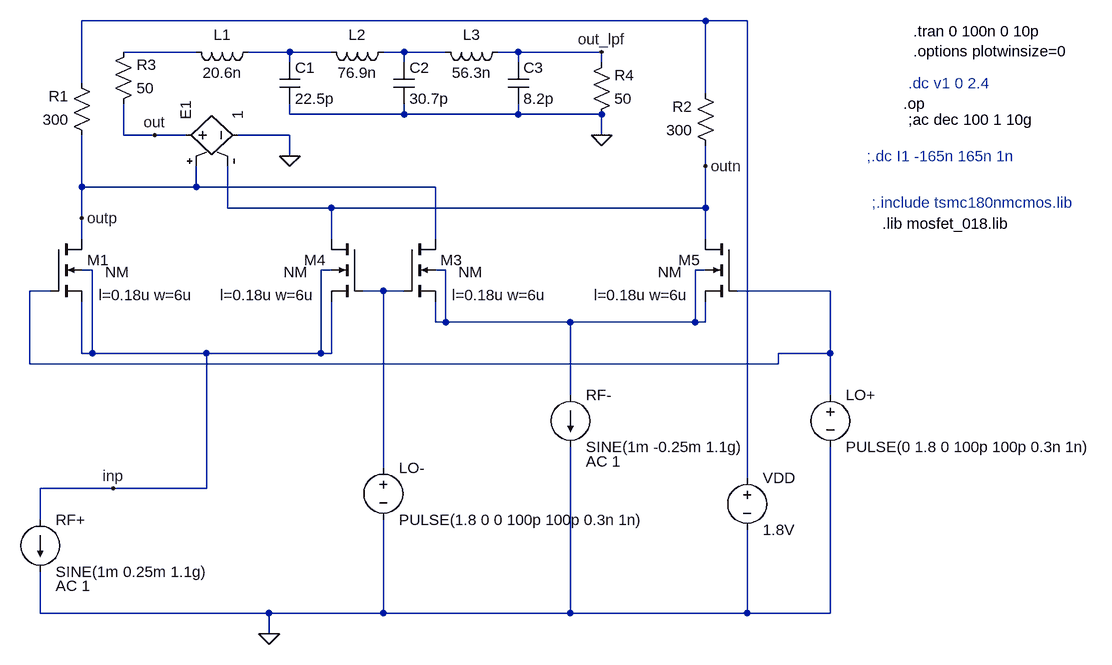
[diagram p0: schematic test_cmos_mixer.asc]
test_cmos_mixer.asc, the LTspice schematic file:
Version 4
SHEET 1 2264 2956
WIRE 1024 -496 64 -496
WIRE 1088 -496 1024 -496
WIRE 240 -448 128 -448
WIRE 384 -448 320 -448
WIRE 448 -448 384 -448
WIRE 560 -448 528 -448
WIRE 624 -448 560 -448
WIRE 736 -448 704 -448
WIRE 864 -448 736 -448
WIRE 384 -432 384 -448
WIRE 560 -432 560 -448
WIRE 736 -432 736 -448
WIRE 864 -432 864 -448
WIRE 64 -400 64 -496
WIRE 1024 -384 1024 -496
WIRE 384 -352 384 -368
WIRE 560 -352 560 -368
WIRE 560 -352 384 -352
WIRE 736 -352 736 -368
WIRE 736 -352 560 -352
WIRE 864 -352 736 -352
WIRE 128 -320 128 -368
WIRE 176 -320 128 -320
WIRE 224 -320 176 -320
WIRE 384 -320 304 -320
WIRE 864 -320 864 -352
WIRE 384 -288 384 -320
WIRE 1024 -272 1024 -304
WIRE 64 -240 64 -320
WIRE 240 -240 240 -272
WIRE 240 -240 64 -240
WIRE 608 -240 240 -240
WIRE 288 -208 288 -272
WIRE 448 -208 288 -208
WIRE 1024 -208 1024 -272
WIRE 1024 -208 448 -208
WIRE 64 -192 64 -240
WIRE 64 -160 64 -192
WIRE 448 -160 448 -208
WIRE 608 -160 608 -240
WIRE 1024 -160 1024 -208
WIRE 80 -112 64 -112
WIRE 448 -112 432 -112
WIRE 624 -112 608 -112
WIRE 1024 -112 1008 -112
WIRE 16 -80 -16 -80
WIRE 528 -80 496 -80
WIRE 560 -80 528 -80
WIRE 1216 -80 1072 -80
WIRE 608 -32 608 -64
WIRE 624 -32 624 -112
WIRE 624 -32 608 -32
WIRE 816 -32 624 -32
WIRE 1008 -32 1008 -112
WIRE 1008 -32 816 -32
WIRE 1024 -32 1024 -64
WIRE 1024 -32 1008 -32
WIRE 64 16 64 -64
WIRE 80 16 80 -112
WIRE 80 16 64 16
WIRE 256 16 80 16
WIRE 432 16 432 -112
WIRE 432 16 256 16
WIRE 448 16 448 -64
WIRE 448 16 432 16
WIRE 1216 16 1216 -80
WIRE 1216 16 1136 16
WIRE -16 32 -16 -80
WIRE 1136 32 1136 16
WIRE 1136 32 -16 32
WIRE 816 80 816 -32
WIRE 1216 80 1216 16
WIRE 528 192 528 -80
WIRE 1088 208 1088 -496
WIRE 112 224 0 224
WIRE 256 224 256 16
WIRE 256 224 112 224
WIRE 0 272 0 224
WIRE 0 416 0 352
WIRE 352 416 0 416
WIRE 528 416 528 272
WIRE 528 416 352 416
WIRE 816 416 816 160
WIRE 816 416 528 416
WIRE 1088 416 1088 288
WIRE 1088 416 816 416
WIRE 1216 416 1216 160
WIRE 1216 416 1088 416
WIRE 352 448 352 416
FLAG 352 448 0
FLAG 112 224 inp
FLAG 64 -192 outp
FLAG 1024 -272 outn
FLAG 384 -288 0
FLAG 176 -320 out
FLAG 864 -320 0
FLAG 864 -448 out_lpf
SYMBOL nmos4 16 -160 R0
WINDOW 3 84 51 Left 2
WINDOW 123 74 86 Left 2
SYMATTR Value NM
SYMATTR Value2 l=0.18u w=6u
SYMATTR InstName M1
SYMBOL voltage 1088 192 R0
WINDOW 123 0 0 Left 2
WINDOW 39 0 0 Left 2
SYMATTR InstName VDD
SYMATTR Value 1.8V
SYMBOL current 0 272 R0
WINDOW 123 24 102 Left 2
SYMATTR Value2 AC 1
SYMATTR InstName RF+
SYMATTR Value SINE(1m 0.25m 1.1g)
SYMBOL res 80 -304 R180
WINDOW 0 36 76 Left 2
WINDOW 3 36 40 Left 2
SYMATTR InstName R1
SYMATTR Value 300
SYMBOL voltage 1216 64 R0
WINDOW 123 0 0 Left 2
WINDOW 39 0 0 Left 2
SYMATTR InstName LO+
SYMATTR Value PULSE(0 1.8 0 100p 100p 0.3n 1n)
SYMBOL current 816 80 R0
WINDOW 123 24 102 Left 2
SYMATTR Value2 AC 1
SYMATTR InstName RF-
SYMATTR Value SINE(1m -0.25m 1.1g)
SYMBOL nmos4 560 -160 R0
WINDOW 3 84 51 Left 2
WINDOW 123 74 86 Left 2
SYMATTR Value NM
SYMATTR Value2 l=0.18u w=6u
SYMATTR InstName M3
SYMBOL nmos4 496 -160 M0
WINDOW 3 84 51 Left 2
WINDOW 123 74 86 Left 2
SYMATTR Value NM
SYMATTR Value2 l=0.18u w=6u
SYMATTR InstName M4
SYMBOL nmos4 1072 -160 M0
WINDOW 3 84 51 Left 2
WINDOW 123 74 86 Left 2
SYMATTR Value NM
SYMATTR Value2 l=0.18u w=6u
SYMATTR InstName M5
SYMBOL voltage 528 176 R0
WINDOW 123 0 0 Left 2
WINDOW 39 0 0 Left 2
SYMATTR InstName LO-
SYMATTR Value PULSE(1.8 0 0 100p 100p 0.3n 1n)
SYMBOL res 1040 -288 R180
WINDOW 0 36 76 Left 2
WINDOW 3 36 40 Left 2
SYMATTR InstName R2
SYMATTR Value 300
SYMBOL e 208 -320 R270
SYMATTR InstName E1
SYMATTR Value 1
SYMBOL res 112 -352 M180
WINDOW 0 36 76 Left 2
WINDOW 3 36 40 Left 2
SYMATTR InstName R3
SYMATTR Value 50
SYMBOL ind 336 -464 R90
WINDOW 0 5 56 VBottom 2
WINDOW 3 32 56 VTop 2
SYMATTR InstName L1
SYMATTR Value 20.6n
SYMBOL ind 544 -464 R90
WINDOW 0 5 56 VBottom 2
WINDOW 3 32 56 VTop 2
SYMATTR InstName L2
SYMATTR Value 76.9n
SYMBOL cap 368 -432 R0
SYMATTR InstName C1
SYMATTR Value 22.5p
SYMBOL cap 544 -432 R0
SYMATTR InstName C2
SYMATTR Value 30.7p
SYMBOL cap 720 -432 R0
SYMATTR InstName C3
SYMATTR Value 8.2p
SYMBOL ind 720 -464 R90
WINDOW 0 5 56 VBottom 2
WINDOW 3 32 56 VTop 2
SYMATTR InstName L3
SYMATTR Value 56.3n
SYMBOL res 848 -336 M180
WINDOW 0 36 76 Left 2
WINDOW 3 36 40 Left 2
SYMATTR InstName R4
SYMATTR Value 50
TEXT 1328 -368 Left 2 !.op
TEXT 1336 -344 Left 2 !;ac dec 100 1 10g
TEXT 1280 -216 Left 2 ;;.include tsmc180nmcmos.lib
TEXT 1272 -288 Left 2 ;;.dc I1 -165n 165n 1n
TEXT 1296 -184 Left 2 !.lib mosfet_018.lib
TEXT 1336 -400 Left 2 ;.dc v1 0 2.4
TEXT 1344 -480 Left 2 !.tran 0 100n 0 10p\n.options plotwinsize=0

The netlist it stands for:
* test_cmos_mixer.asc
M1 outp N006 inp inp NM l=0.18u w=6u
VDD N001 0 1.8V
I§RF+ inp 0 SINE(1m 0.25m 1.1g) AC 1
R1 outp N001 300
V§LO+ N006 0 PULSE(0 1.8 0 100p 100p 0.3n 1n)
I§RF- N005 0 SINE(1m -0.25m 1.1g) AC 1
M3 outp N007 N005 N005 NM l=0.18u w=6u
M4 outn N007 inp inp NM l=0.18u w=6u
M5 outn N006 N005 N005 NM l=0.18u w=6u
V§LO- N007 0 PULSE(1.8 0 0 100p 100p 0.3n 1n)
R2 outn N001 300
E1 out 0 outp outn 1
R3 out N002 50
L1 N003 N002 20.6n
L2 N004 N003 76.9n
C1 N003 0 22.5p
C2 N004 0 30.7p
C3 out_lpf 0 8.2p
L3 out_lpf N004 56.3n
R4 0 out_lpf 50
.model NMOS NMOS
.model PMOS PMOS
.lib standard.mos
.op
;ac dec 100 1 10g
* ;.include tsmc180nmcmos.lib
* ;.dc I1 -165n 165n 1n
.lib mosfet_018.lib
* .dc v1 0 2.4
.tran 0 100n 0 10p
.options plotwinsize=0
.backanno
.end